# Altium schematic sheet fan&temp.SchDoc
size 594 x 420 mm
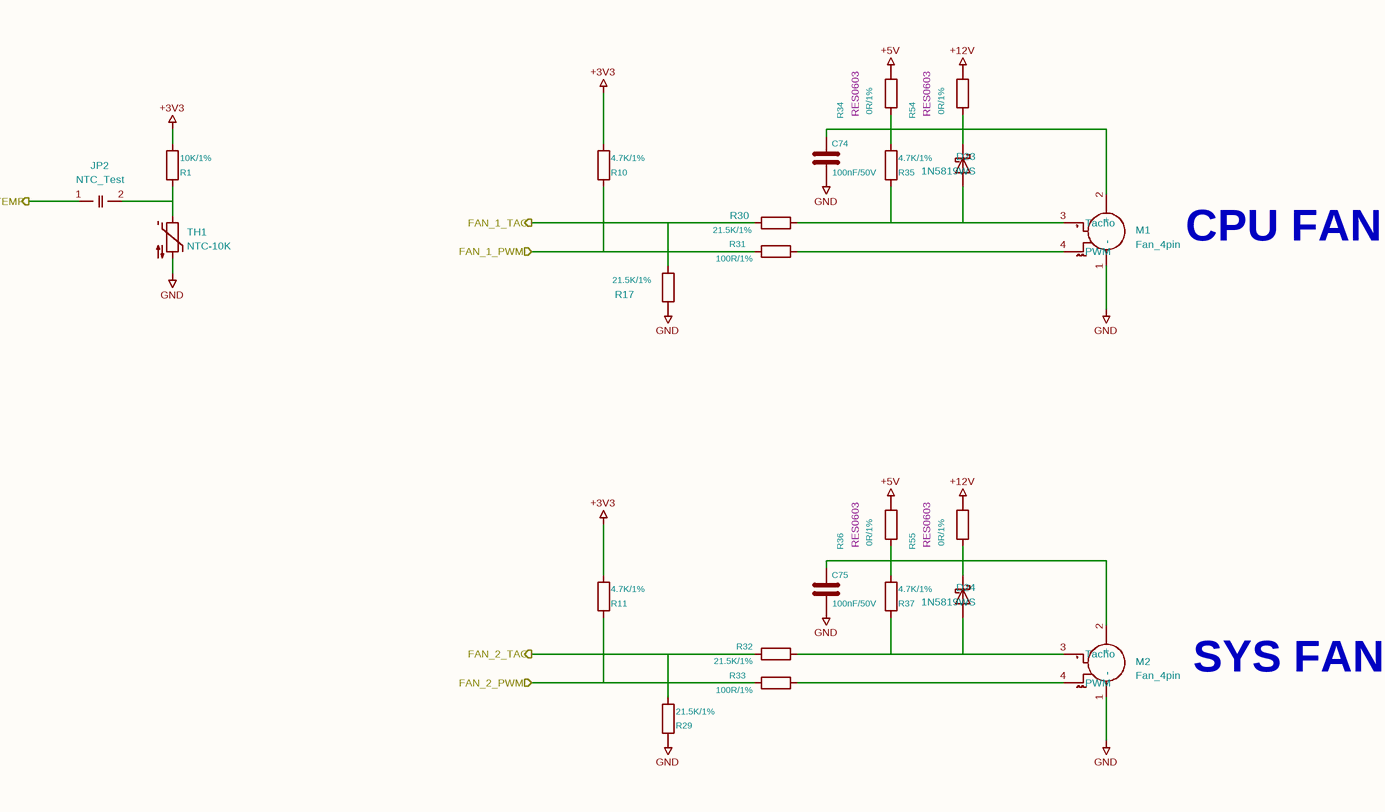
[diagram p0: fan&temp.SchDoc]

## Parts
C74  100nF/50V  [C_0402_1005Metric]
C75  100nF/50V  [C_0402_1005Metric]
D23  1N5819WS  [D_SOD-323]
D24  1N5819WS  [D_SOD-323]
JP2  NTC_Test  [SolderJumper-2_P1.3mm_Open_RoundedPad1.0x1.5mm]
M1  Fan_4pin  [JST_PH_B4B-PH-K_1x04_P2.00mm_Vertical]
M2  Fan_4pin  [JST_PH_B4B-PH-K_1x04_P2.00mm_Vertical]
R1  10K/1%  [R_0402_1005Metric]
R10  4.7K/1%  [R_0402_1005Metric]
R11  4.7K/1%  [R_0402_1005Metric]
R17  21.5K/1%  [R_0402_1005Metric]
R29  21.5K/1%  [R_0402_1005Metric]
R30  21.5K/1%  [R_0402_1005Metric]
R31  100R/1%  [R_0402_1005Metric]
R32  21.5K/1%  [R_0402_1005Metric]
R33  100R/1%  [R_0402_1005Metric]
R34  0R/1%  [RES0603]
R35  4.7K/1%  [R_0402_1005Metric]
R36  0R/1%  [RES0603]
R37  4.7K/1%  [R_0402_1005Metric]
R54  0R/1%  [RES0603]
R55  0R/1%  [RES0603]
TH1  NTC-10K  [R_0603_1608Metric]

## Ports
FAN_1_PWM (in), FAN_1_TAC (out), FAN_2_PWM (in), FAN_2_TAC (out), TEMP (out)

## Nets
+3V3: R1.1 R10.1 R11.1
+5V: R34.2 R36.2
+12V: R54.2 R55.2
GND: C74.2 C75.2 M1.1(-) M2.1(-) R17.2 R29.2 TH1.2
FAN_1_PWM: R10.2 R31.1 ; port FAN_1_PWM
FAN_1_TAC: R17.1 R30.2 ; port FAN_1_TAC
FAN_2_PWM: R11.2 R33.1 ; port FAN_2_PWM
FAN_2_TAC: R29.1 R32.1 ; port FAN_2_TAC
TEMP: JP2.1(A) ; port TEMP
NetC74_1: C74.1 D23.1(K) M1.2(+) R34.1 R35.1 R54.1
NetC75_1: C75.1 D24.1(K) M2.2(+) R36.1 R37.1 R55.1
NetD23_2: D23.2(A) M1.3(Tacho) R30.1 R35.2
NetD24_2: D24.2(A) M2.3(Tacho) R32.2 R37.2
NetJP2_2: JP2.2(B) R1.2 TH1.1
NetM1_4: M1.4(PWM) R31.2
NetM2_4: M2.4(PWM) R33.2

## Notes on the sheet
- CPU FAN
- SYS FAN
- 1
- 2
- 3
- 4
- 5
- 6
- 7
- 8
- 9
- 10
- 11
- A
- B
- C
- D
- E
- F
- G
- H
- Title:
- File: fan&temp.kicad_sch
- Sheet: /
- KiCad E.D.A.  kicad (5.1.4)-1
- Size: A2
- Date:
- Rev:
- Id: 1/1

## Library data of the parts
C74 C75 = C: DF_Comment: 贴片电容0402-100nF-50V-X7R_CC0402KRX7R9BB104; SCH_Show_Footprint: C0402; Value: 100nF/50V; Footprint: Capacitor_SMD:C_0402_1005Metric
D23 D24 = 1N5819WS: DF_Comment: 二极管-1N5819W-SOD323备选型号:B5819WS、JSPD140A; SCH_Show_Footprint: SOD-323; Value: 1N5819WS; Footprint: Diode_SMD:D_SOD-323
JP2 = SolderJumper_2_Open: Value: NTC_Test; Footprint: Jumper:SolderJumper-2_P1.3mm_Open_RoundedPad1.0x1.5mm
M1 M2 = Fan_4pin: DF_Comment: JST-B4B-PH-K(LF)(SN); Buy_Link: https://item.szlcsc.com/255571.html; Value: Fan_4pin; Footprint: Connector_JST:JST_PH_B4B-PH-K_1x04_P2.00mm_Vertical
R1 = R: DF_Comment: 贴片电阻0402-10K-1%; Value: 10K/1%; Footprint: Resistor_SMD:R_0402_1005Metric
R10 R11 R35 R37 = R: DF_Comment: 贴片电阻0402-4.7K-1%; Value: 4.7K/1%; Footprint: Resistor_SMD:R_0402_1005Metric
R17 R29 R30 R32 = R: DF_Comment: 贴片电阻0402-21.5K-1%; Value: 21.5K/1%; Footprint: Resistor_SMD:R_0402_1005Metric
R31 R33 = R: DF_Comment: 贴片电阻0402-100R-1%; Value: 100R/1%; Footprint: Resistor_SMD:R_0402_1005Metric
R34 R36 R54 R55 = R: DF_Comment: 贴片电阻0603-0R-5%(0603-1.6*0.8*0.4); Value: 0R/1%
TH1 = Thermistor_NTC: DF_Comment: 贴片热敏电阻0603-NCP18XH103F03RB-10K; Value: NTC-10K; Footprint: Resistor_SMD:R_0603_1608Metric